# Altium schematic sheet ddr3.SchDoc: Virtex-6 DDR3 DIMM
size A3; Date: DO NOT USE, RATHER USE PROJ OPTIONS; DrawnBy: DO NOT USE, RATHER USE PROJ OPTIONS; Engineer: DO NOT USE, RATHER USE PROJ OPTIONS; Organization: DO NOT USE, RATHER USE PROJ OPTIONS; DocumentNumber: DO NOT USE, RATHER USE PROJ OPTIONS; Revision: DO NOT USE, RATHER USE PROJ OPTIONS; SheetNumber: 21; SheetTotal: 29; SCH_Sheet_Filename: ddr3.SchDoc; CurrentTime: DO NOT USE, RATHER USE PROJ OPTIONS; Time: DO NOT USE, RATHER USE PROJ OPTIONS; DocumentFullPathAndName: DO NOT USE, RATHER USE PROJ OPTIONS; DocumentName: DO NOT USE, RATHER USE PROJ OPTIONS; ModifiedDate: DO NOT USE, RATHER USE PROJ OPTIONS; ImagePath: DO NOT USE, RATHER USE PROJ OPTIONS
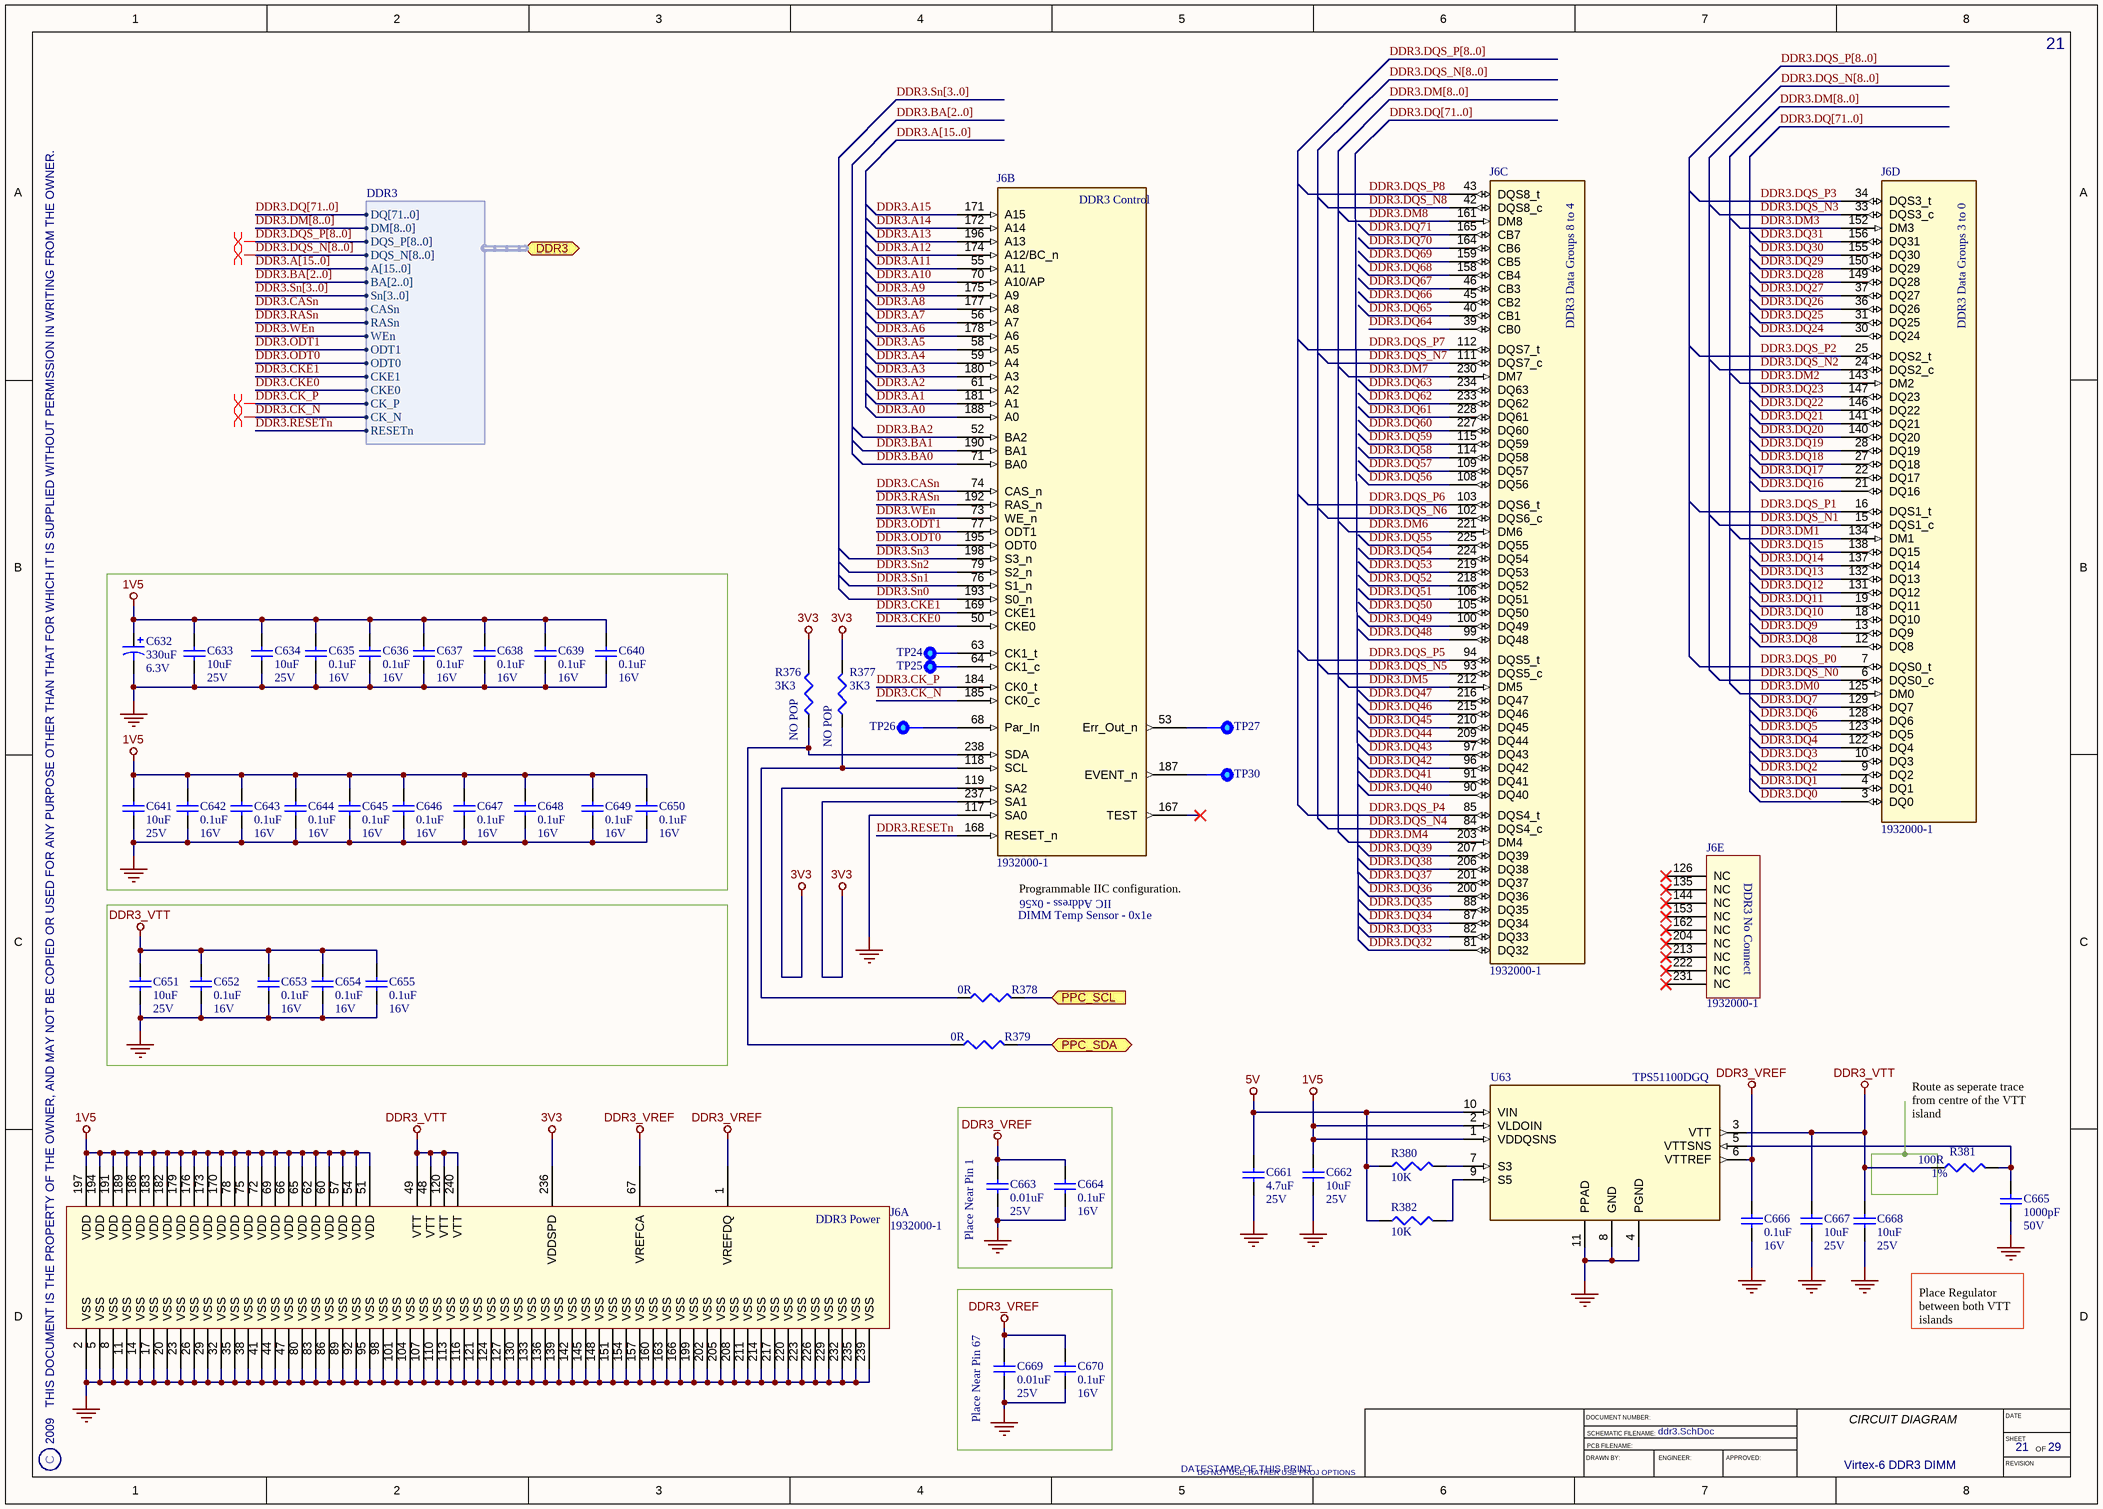
[diagram p0: ddr3.SchDoc]

## Parts
C632  Rating: 6.3V  [CAPMP7343X280L]  (hidden comment: 330uF)
C633  Rating: 25V  [CAPC3225X200L]  (hidden comment: 10uF)
C634  Rating: 25V  [CAPC3225X200L]  (hidden comment: 10uF)
C635  Rating: 16V  [CAPC1005X60L]  (hidden comment: 0.1uF)
C636  Rating: 16V  [CAPC1005X60L]  (hidden comment: 0.1uF)
C637  Rating: 16V  [CAPC1005X60L]  (hidden comment: 0.1uF)
C638  Rating: 16V  [CAPC1005X60L]  (hidden comment: 0.1uF)
C639  Rating: 16V  [CAPC1005X60L]  (hidden comment: 0.1uF)
C640  Rating: 16V  [CAPC1005X60L]  (hidden comment: 0.1uF)
C641  Rating: 25V  [CAPC3225X200L]  (hidden comment: 10uF)
C642  Rating: 16V  [CAPC1005X60L]  (hidden comment: 0.1uF)
C643  Rating: 16V  [CAPC1005X60L]  (hidden comment: 0.1uF)
C644  Rating: 16V  [CAPC1005X60L]  (hidden comment: 0.1uF)
C645  Rating: 16V  [CAPC1005X60L]  (hidden comment: 0.1uF)
C646  Rating: 16V  [CAPC1005X60L]  (hidden comment: 0.1uF)
C647  Rating: 16V  [CAPC1005X60L]  (hidden comment: 0.1uF)
C648  Rating: 16V  [CAPC1005X60L]  (hidden comment: 0.1uF)
C649  Rating: 16V  [CAPC1005X60L]  (hidden comment: 0.1uF)
C650  Rating: 16V  [CAPC1005X60L]  (hidden comment: 0.1uF)
C651  Rating: 25V  [CAPC3225X200L]  (hidden comment: 10uF)
C652  Rating: 16V  [CAPC1005X60L]  (hidden comment: 0.1uF)
C653  Rating: 16V  [CAPC1005X60L]  (hidden comment: 0.1uF)
C654  Rating: 16V  [CAPC1005X60L]  (hidden comment: 0.1uF)
C655  Rating: 16V  [CAPC1005X60L]  (hidden comment: 0.1uF)
C661  Rating: 25V  [CAPC2012X127L]  (hidden comment: 4.7uF)
C662  Rating: 25V  [CAPC3225X200L]  (hidden comment: 10uF)
C663  Rating: 25V  [CAPC1005X55L]  (hidden comment: 0.01uF)
C664  Rating: 16V  [CAPC1005X60L]  (hidden comment: 0.1uF)
C665  Rating: 50V  [CAPC1005X55L]  (hidden comment: 1000pF)
C666  Rating: 16V  [CAPC1005X60L]  (hidden comment: 0.1uF)
C667  Rating: 25V  [CAPC3225X200L]  (hidden comment: 10uF)
C668  Rating: 25V  [CAPC3225X200L]  (hidden comment: 10uF)
C669  Rating: 25V  [CAPC1005X55L]  (hidden comment: 0.01uF)
C670  Rating: 16V  [CAPC1005X60L]  (hidden comment: 0.1uF)
J6  1932000-1  [TYCO_1932000-1]  (parts A,B,C,D,E of 5)
R376  3K3  [RESC1005X40L]
R377  3K3  [RESC1005X40L]
R378  0R  [RESC1005X40L]
R379  0R  [RESC1005X40L]
R380  10K  [RESC1005X40L]
R381  Tolerance: 1%  [RESC1005X40L]  (hidden comment: 100R)
R382  10K  [RESC1005X40L]
TP24  Testpoint  [TP100]  (value not drawn)  (no BOM)
TP25  Testpoint  [TP100]  (value not drawn)  (no BOM)
TP26  Testpoint  [TP100]  (value not drawn)  (no BOM)
TP27  Testpoint  [TP100]  (value not drawn)  (no BOM)
TP30  Testpoint  [TP100]  (value not drawn)  (no BOM)
U63  TPS51100DGQ  [MSOP_10-N]

## Blocks framed on the sheet
Place Near Pin 1: C663 C664
Place Near Pin 67: C669 C670

## Ports
DDR3 (harness DDR3), PPC_SCL (in), PPC_SDA (bidir)

## Harnesses
DDR3: DQ[71..0], DM[8..0], DQS_P[8..0], DQS_N[8..0], A[15..0], BA[2..0], Sn[3..0], CASn, RASn, WEn, ODT1, ODT0, CKE1, CKE0, CK_P, CK_N, RESETn

## Nets
1V5: C632.1 C633.2 C634.2 C635.2 C636.2 C637.2 C638.2 C639.2 C640.2 C641.2 C642.2 C643.2 C644.2 C645.2 C646.2 C647.2 C648.2 C649.2 C650.2 C662.2 J6.51(VDD) J6.54(VDD) J6.57(VDD) J6.60(VDD) J6.62(VDD) J6.65(VDD) J6.66(VDD) J6.69(VDD) J6.72(VDD) J6.75(VDD) J6.78(VDD) J6.170(VDD) J6.173(VDD) J6.176(VDD) J6.179(VDD) J6.182(VDD) J6.183(VDD) J6.186(VDD) J6.189(VDD) J6.191(VDD) J6.194(VDD) J6.197(VDD) U63.1(VDDQSNS) U63.2(VLDOIN)
3V3: J6.119(SA2) J6.236(VDDSPD) J6.237(SA1) R376.2 R377.2
5V: C661.2 R380.1 R382.1 U63.10(VIN)
DDR3_VREF: C663.2 C664.2 C666.2 C669.2 C670.2 J6.1(VREFDQ) J6.67(VREFCA) U63.6(VTTREF)
DDR3_VTT: C651.2 C652.2 C653.2 C654.2 C655.2 C667.2 C668.2 J6.48(VTT) J6.49(VTT) J6.120(VTT) J6.240(VTT) R381.1 U63.3(VTT)
GND: C632.2 C633.1 C634.1 C635.1 C636.1 C637.1 C638.1 C639.1 C640.1 C641.1 C642.1 C643.1 C644.1 C645.1 C646.1 C647.1 C648.1 C649.1 C650.1 C651.1 C652.1 C653.1 C654.1 C655.1 C661.1 C662.1 C663.1 C664.1 C665.1 C666.1 C667.1 C668.1 C669.1 C670.1 J6.2(VSS) J6.5(VSS) J6.8(VSS) J6.11(VSS) J6.14(VSS) J6.17(VSS) J6.20(VSS) J6.23(VSS) J6.26(VSS) J6.29(VSS) J6.32(VSS) J6.35(VSS) J6.38(VSS) J6.41(VSS) J6.44(VSS) J6.47(VSS) J6.80(VSS) J6.83(VSS) J6.86(VSS) J6.89(VSS) J6.92(VSS) J6.95(VSS) J6.98(VSS) J6.101(VSS) J6.104(VSS) J6.107(VSS) J6.110(VSS) J6.113(VSS) J6.116(VSS) J6.117(SA0) J6.121(VSS) J6.124(VSS) J6.127(VSS) J6.130(VSS) J6.133(VSS) J6.136(VSS) J6.139(VSS) J6.142(VSS) J6.145(VSS) J6.148(VSS) J6.151(VSS) J6.154(VSS) J6.157(VSS) J6.160(VSS) J6.163(VSS) J6.166(VSS) J6.199(VSS) J6.202(VSS) J6.205(VSS) J6.208(VSS) J6.211(VSS) J6.214(VSS) J6.217(VSS) J6.220(VSS) J6.223(VSS) J6.226(VSS) J6.229(VSS) J6.232(VSS) J6.235(VSS) J6.239(VSS) U63.4(PGND) U63.8(GND) U63.11(PPAD)
DDR3.A0: J6.188(A0)
DDR3.A1: J6.181(A1)
DDR3.A2: J6.61(A2)
DDR3.A3: J6.180(A3)
DDR3.A4: J6.59(A4)
DDR3.A5: J6.58(A5)
DDR3.A6: J6.178(A6)
DDR3.A7: J6.56(A7)
DDR3.A8: J6.177(A8)
DDR3.A9: J6.175(A9)
DDR3.A10: J6.70(A10/AP)
DDR3.A11: J6.55(A11)
DDR3.A12: J6.174(A12/BC_n)
DDR3.A13: J6.196(A13)
DDR3.A14: J6.172(A14)
DDR3.A15: J6.171(A15)
DDR3.BA0: J6.71(BA0)
DDR3.BA1: J6.190(BA1)
DDR3.BA2: J6.52(BA2)
DDR3.CASn: J6.74(CAS_n) ; port DDR3.CASn
DDR3.CK_N: J6.185(CK0_c) ; port DDR3.CK_N
DDR3.CK_P: J6.184(CK0_t) ; port DDR3.CK_P
DDR3.CKE0: J6.50(CKE0) ; port DDR3.CKE0
DDR3.CKE1: J6.169(CKE1) ; port DDR3.CKE1
DDR3.DM0: J6.125(DM0)
DDR3.DM1: J6.134(DM1)
DDR3.DM2: J6.143(DM2)
DDR3.DM3: J6.152(DM3)
DDR3.DM4: J6.203(DM4)
DDR3.DM5: J6.212(DM5)
DDR3.DM6: J6.221(DM6)
DDR3.DM7: J6.230(DM7)
DDR3.DM8: J6.161(DM8)
DDR3.DQ0: J6.3(DQ0)
DDR3.DQ1: J6.4(DQ1)
DDR3.DQ2: J6.9(DQ2)
DDR3.DQ3: J6.10(DQ3)
DDR3.DQ4: J6.122(DQ4)
DDR3.DQ5: J6.123(DQ5)
DDR3.DQ6: J6.128(DQ6)
DDR3.DQ7: J6.129(DQ7)
DDR3.DQ8: J6.12(DQ8)
DDR3.DQ9: J6.13(DQ9)
DDR3.DQ10: J6.18(DQ10)
DDR3.DQ11: J6.19(DQ11)
DDR3.DQ12: J6.131(DQ12)
DDR3.DQ13: J6.132(DQ13)
DDR3.DQ14: J6.137(DQ14)
DDR3.DQ15: J6.138(DQ15)
DDR3.DQ16: J6.21(DQ16)
DDR3.DQ17: J6.22(DQ17)
DDR3.DQ18: J6.27(DQ18)
DDR3.DQ19: J6.28(DQ19)
DDR3.DQ20: J6.140(DQ20)
DDR3.DQ21: J6.141(DQ21)
DDR3.DQ22: J6.146(DQ22)
DDR3.DQ23: J6.147(DQ23)
DDR3.DQ24: J6.30(DQ24)
DDR3.DQ25: J6.31(DQ25)
DDR3.DQ26: J6.36(DQ26)
DDR3.DQ27: J6.37(DQ27)
DDR3.DQ28: J6.149(DQ28)
DDR3.DQ29: J6.150(DQ29)
DDR3.DQ30: J6.155(DQ30)
DDR3.DQ31: J6.156(DQ31)
DDR3.DQ32: J6.81(DQ32)
DDR3.DQ33: J6.82(DQ33)
DDR3.DQ34: J6.87(DQ34)
DDR3.DQ35: J6.88(DQ35)
DDR3.DQ36: J6.200(DQ36)
DDR3.DQ37: J6.201(DQ37)
DDR3.DQ38: J6.206(DQ38)
DDR3.DQ39: J6.207(DQ39)
DDR3.DQ40: J6.90(DQ40)
DDR3.DQ41: J6.91(DQ41)
DDR3.DQ42: J6.96(DQ42)
DDR3.DQ43: J6.97(DQ43)
DDR3.DQ44: J6.209(DQ44)
DDR3.DQ45: J6.210(DQ45)
DDR3.DQ46: J6.215(DQ46)
DDR3.DQ47: J6.216(DQ47)
DDR3.DQ48: J6.99(DQ48)
DDR3.DQ49: J6.100(DQ49)
DDR3.DQ50: J6.105(DQ50)
DDR3.DQ51: J6.106(DQ51)
DDR3.DQ52: J6.218(DQ52)
DDR3.DQ53: J6.219(DQ53)
DDR3.DQ54: J6.224(DQ54)
DDR3.DQ55: J6.225(DQ55)
DDR3.DQ56: J6.108(DQ56)
DDR3.DQ57: J6.109(DQ57)
DDR3.DQ58: J6.114(DQ58)
DDR3.DQ59: J6.115(DQ59)
DDR3.DQ60: J6.227(DQ60)
DDR3.DQ61: J6.228(DQ61)
DDR3.DQ62: J6.233(DQ62)
DDR3.DQ63: J6.234(DQ63)
DDR3.DQ64: J6.39(CB0)
DDR3.DQ65: J6.40(CB1)
DDR3.DQ66: J6.45(CB2)
DDR3.DQ67: J6.46(CB3)
DDR3.DQ68: J6.158(CB4)
DDR3.DQ69: J6.159(CB5)
DDR3.DQ70: J6.164(CB6)
DDR3.DQ71: J6.165(CB7)
DDR3.DQS_N0: J6.6(DQS0_c)
DDR3.DQS_N1: J6.15(DQS1_c)
DDR3.DQS_N2: J6.24(DQS2_c)
DDR3.DQS_N3: J6.33(DQS3_c)
DDR3.DQS_N4: J6.84(DQS4_c)
DDR3.DQS_N5: J6.93(DQS5_c)
DDR3.DQS_N6: J6.102(DQS6_c)
DDR3.DQS_N7: J6.111(DQS7_c)
DDR3.DQS_N8: J6.42(DQS8_c)
DDR3.DQS_P0: J6.7(DQS0_t)
DDR3.DQS_P1: J6.16(DQS1_t)
DDR3.DQS_P2: J6.25(DQS2_t)
DDR3.DQS_P3: J6.34(DQS3_t)
DDR3.DQS_P4: J6.85(DQS4_t)
DDR3.DQS_P5: J6.94(DQS5_t)
DDR3.DQS_P6: J6.103(DQS6_t)
DDR3.DQS_P7: J6.112(DQS7_t)
DDR3.DQS_P8: J6.43(DQS8_t)
DDR3.ODT0: J6.195(ODT0) ; port DDR3.ODT0
DDR3.ODT1: J6.77(ODT1) ; port DDR3.ODT1
DDR3.RASn: J6.192(RAS_n) ; port DDR3.RASn
DDR3.RESETn: J6.168(RESET_n) ; port DDR3.RESETn
DDR3.Sn0: J6.193(S0_n)
DDR3.Sn1: J6.76(S1_n)
DDR3.Sn2: J6.79(S2_n)
DDR3.Sn3: J6.198(S3_n)
DDR3.WEn: J6.73(WE_n) ; port DDR3.WEn
PPC_SCL: R378.2 ; port PPC_SCL
PPC_SDA: R379.2 ; port PPC_SDA
NetC665_2: C665.2 R381.2 U63.5(VTTSNS)
NetJ6_53: J6.53(Err_Out_n) TP27.1
NetJ6_63: J6.63(CK1_t) TP24.1
NetJ6_64: J6.64(CK1_c) TP25.1
NetJ6_68: J6.68(Par_In) TP26.1
NetJ6_118: J6.118(SCL) R377.1 R378.1
NetJ6_187: J6.187(EVENT_n) TP30.1
NetJ6_238: J6.238(SDA) R376.1 R379.1
NetR380_2: R380.2 U63.7(S3)
NetR382_2: R382.2 U63.9(S5)

Not connected (* = marked no-connect by the designer): J6 126(NC)* 135(NC)* 144(NC)* 153(NC)* 162(NC)* 167(TEST)* 204(NC)* 213(NC)* 222(NC)* 231(NC)*

## Buses and harness runs
bus DDR3.A[15..0]
bus DDR3.BA[2..0]
bus DDR3.DM[8..0]
bus DDR3.DQ[71..0]
bus DDR3.DQS_N[8..0]
bus DDR3.DQS_P[8..0]
bus DDR3.Sn[3..0]

## Layout directives
differential pair: (no net found under the mark), DDR3.CK_N, DDR3.CK_P

## Notes on the sheet
- (near R376) NO POP
- NO POP
- (near J6) Programmable IIC configuration.
- DIMM Temp Sensor - 0x1e
- IIC Address - 0x56
- Route as seperate trace from centre of the VTT island
- Place Regulator between both VTT islands
- 2009   THIS DOCUMENT IS THE PROPERTY OF THE OWNER, AND MAY NOT BE COPIED OR USED FOR ANY PURPOSE OTHER THAN THAT FOR WHICH IT IS SUPPLIED WITHOUT PERMISSION IN WRITING FROM THE OWNER.
- C
- DATESTAMP OF THIS PRINT
- DRAWN BY:
- DOCUMENT NUMBER:
- SCHEMATIC FILENAME:
- PCB FILENAME:
- ENGINEER:
- APPROVED:
- CIRCUIT DIAGRAM
- DATE
- SHEET
- REVISION
- OF
- (in symbol CONN-PCB-3, part A) DDR3 Power
- (in symbol CONN-PCB-3, part B) DDR3 Control
- (in symbol CONN-PCB-3, part C) DDR3 Data Groups 8 to 4
- (in symbol CONN-PCB-3, part D) DDR3 Data Groups 3 to 0
- (in symbol CONN-PCB-3, part E) DDR3 No Connect

## Library data of the parts
C632 = CAP-TAN-2: 330uF, Conductive Polymer Chip Capacitor; Manufacturer: KEMET; PartNum: T520D337M006ATE045; Tolerance: 20%; ESR: 0.05; POD number: CAP-TAN-2; Value: 330uF; RoHS: Y; Sort Value: 330; Category: Capacitors; Subcategory: Tantalum
C633 C634 C641 C651 C662 C667 C668 = CAP-CER-5: 10uF, Ceramic Capacitor; Manufacturer: MURATA; PartNum: GRM32DR61E106KA12L; Tolerance: 10%; Dielectric: X5R; POD number: CAP-CER-5; Value: 10uF; RoHS: Y; Sort Value: 100; Category: Capacitors; Subcategory: Ceramic
C635-C640 C642-C650 C652-C655 C664 C666 C670 = CAP-CER-1: 0.1uF, Ceramic Capacitor; Manufacturer: VENKEL; PartNum: C0402X7R160-104KN; Tolerance: 10%; Dielectric: X7R; POD number: CAP-CER-1; Value: 0.1uF; RoHS: Y; Sort Value: 0.1; Category: Capacitors; Subcategory: Ceramic
C661 = CAP-CER-3: 4.7uF, Ceramic Capacitor; Manufacturer: MURATA; PartNum: GRM21BR61E475KA12K; Tolerance: 10%; Dielectric: X5R; POD number: CAP-CER-3; Value: 4.7uF; RoHS: Y; Sort Value: 4.7; Category: Capacitors; Subcategory: Ceramic
C663 C669 = CAP-CER-6: 0.01uF, Ceramic Capacitor; Manufacturer: MURATA; PartNum: GRM155R71E103KA01D; Tolerance: 10%; Dielectric: X7R; POD number: CAP-CER-6; Value: 0.01uF; RoHS: Y; Sort Value: 0.01; Category: Capacitors; Subcategory: Ceramic
C665 = CAP-CER-4: 1000pF, Ceramic Capacitor; Manufacturer: MURATA; PartNum: GRM155R61H102KA01D; Tolerance: 10%; Dielectric: X5R; POD number: CAP-CER-4; Value: 1000pF; RoHS: Y; Sort Value: 0.0001; Category: Capacitors; Subcategory: Ceramic
J6 = CONN-PCB-3: 240-pin DDR3 DIMM Socket; Manufacturer: TYCO; POD number: CONN-PCB-3; PartNum: 1932000-1; RoHS: Y; Category: CONN; Subcategory: PCB
R376 R377 = RES-TF-7: 3K3, 1.1mm x 0.5mm, Thick Film Resistor; Manufacturer: ROYALOHM; PartNum: 0402WGJ0332T1E; Tolerance: 5%; Rating: 0.0625W; POD number: RES-TF-7; Value: 3K3; Sort Value: 3300; Category: Resistors; Subcategory: ThickFilm; HelpURL: *.pdf
R378 R379 = RES-TF-0: 0R, 1.1mm x 0.5mm, Thick Film Resistor; Manufacturer: ROYALOHM; PartNum: 0402WG00000T1E; Tolerance: 0%; Rating: 0.0625W; POD number: RES-TF-0; RoHS: Y; Value: 0R; Sort Value: 0; Category: Resistors; Subcategory: ThickFilm; HelpURL: http://www.royalohm.com/pdf/general.pdf
R380 R382 = RES-TF-5: 10K, 1.1mm x 0.5mm, Thick Film Resistor; Manufacturer: ROYALOHM; PartNum: 0402WGJ0103T1E; Tolerance: 5%; Rating: 0.0625W; POD number: RES-TF-5; Value: 10K; Sort Value: 10000; Category: Resistors; Subcategory: ThickFilm; HelpURL: *.pdf
R381 = RES-TF-14: 100R, 1.1mm x 0.5mm, Thick Film Resistor; Manufacturer: ROYALOHM; PartNum: 0402WGF0101T1E; Rating: 0.0625W; POD number: RES-TF-14; Value: 100R; Sort Value: 1000; Category: Resistors; Subcategory: ThickFilm; HelpURL: *.pdf
TP24-TP27 TP30 = ELMECH-TP-0: 1mm Diameter, through-hole, Circular Test-point; POD number: ELMECH-TP-0; RoHS: Y; Category: ELMECH; Subcategory: Test Points
U63 = IC-REG-6: 3A Sink/Source Regulator; Manufacturer: Texas Instruments; POD number: IC-REG-6; PartNum: TPS51100DGQ; RoHS: Y; Category: IC; Subcategory: Regulators